# EAGLE design nxtMini (EAGLE 9.6.1)
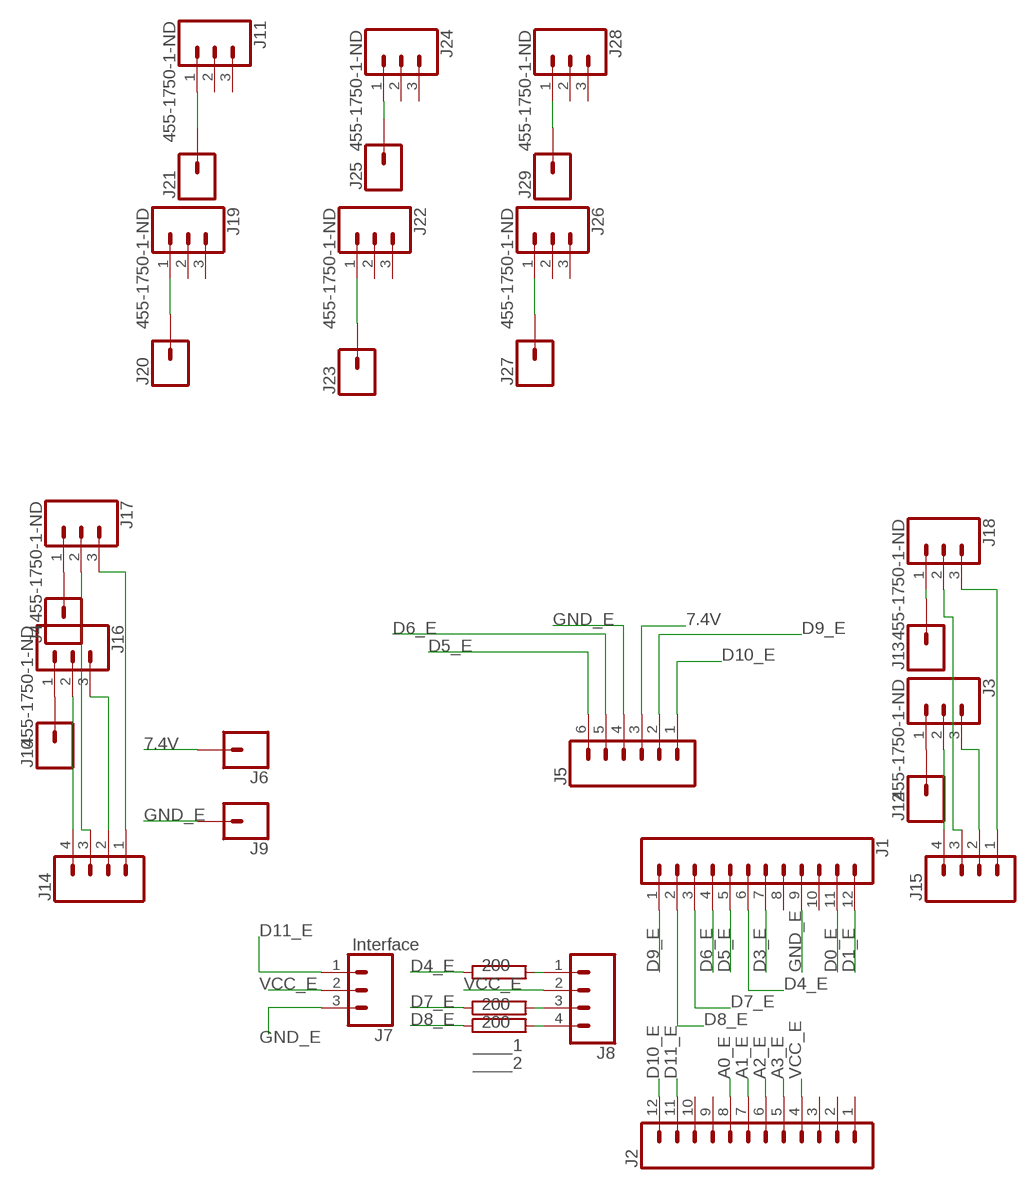
[diagram p0: schematic, sheet 1]

## Parts
200  RCA0001  [CA0001]
____1  200  RCA0001  [CA0001]
____2  200  RCA0001  [CA0001]
J1  CONN_12  [1X12]
J2  CONN_12  [1X12]
J3  455-1750-1-ND  CONN_03  [1X03]
J4  CONN_01  [1X01]
J5  CONN_06SILK_FEMALE_PTH  [1X06]
J6  CONN_01  [1X01]
J7  Interface  CONN_03  [1X03]
J8  CONN_04  [1X04]
J9  CONN_01  [1X01]
J10  CONN_01  [1X01]
J11  455-1750-1-ND  CONN_03  [1X03]
J12  CONN_01  [1X01]
J13  CONN_01  [1X01]
J14  CONN_04  [1X04]
J15  CONN_04  [1X04]
J16  455-1750-1-ND  CONN_03  [1X03]
J17  455-1750-1-ND  CONN_03  [1X03]
J18  455-1750-1-ND  CONN_03  [1X03]
J19  455-1750-1-ND  CONN_03  [1X03]
J20  CONN_01  [1X01]
J21  CONN_01  [1X01]
J22  455-1750-1-ND  CONN_03  [1X03]
J23  CONN_01  [1X01]
J24  455-1750-1-ND  CONN_03  [1X03]
J25  CONN_01  [1X01]
J26  455-1750-1-ND  CONN_03  [1X03]
J27  CONN_01  [1X01]
J28  455-1750-1-ND  CONN_03  [1X03]
J29  CONN_01  [1X01]

## Nets
7.4V: J5.3 J6.1
A0_E: J2.8
A1_E: J2.7
A2_E: J2.6
A3_E: J2.5
D0_E: J1.11
D1_E: J1.12
D3_E: J1.7
D4_E: 200.1 J1.6
D5_E: J1.5 J5.6
D6_E: J1.4 J5.5
D7_E: ____1.1 J1.3
D8_E: ____2.1 J1.2
D9_E: J1.1 J5.2
D10_E: J2.12 J5.1
D11_E: J2.11 J7.1
GND_E: J1.9 J5.4 J7.3 J9.1
N$1: J4.1 J17.1
N$2: J10.1 J16.1
N$3: 200.2 J8.1
N$4: ____1.2 J8.3
N$5: ____2.2 J8.4
N$6: J3.1 J12.1
N$7: J13.1 J18.1
N$8: J14.4 J16.2
N$9: J14.3 J17.2
N$10: J14.2 J16.3
N$11: J14.1 J17.3
N$12: J3.2 J15.4
N$13: J15.3 J18.2
N$14: J3.3 J15.2
N$15: J15.1 J18.3
N$16: J19.1 J20.1
N$17: J11.1 J21.1
N$18: J22.1 J23.1
N$19: J24.1 J25.1
N$20: J26.1 J27.1
N$21: J28.1 J29.1
VCC_E: J2.4 J7.2 J8.2
Unconnected: J1.8 J1.10 J2.1 J2.2 J2.3 J2.9 J2.10 J11.2 J11.3 J19.2 J19.3 J22.2 J22.3 J24.2 J24.3 J26.2 J26.3 J28.2 J28.3

## Library data of the parts
200 ____1 ____2 = resistor-power:R: Power Resitor; OC_FARNELL: unknown; OC_NEWARK: unknown
J1 J2 = SparkFun-Connectors:CONN_12: Multi connection point. Often used as Generic Header-pin footprint for 0.1 inch spaced/style header connections On any of the 0.1 inch spaced packages, you can populate with these: Break Away Headers - Straight <https://www.sparkfun.com/products/116> (PRT-00116) Break Away Male Headers - Right Angle <https://www.sparkfun.com/products/553> (PRT-00553) Female Headers <https://www.sparkfun.com/products/115> (PRT-00115) Break Away Headers - Machine Pin <https://www.sparkfun.com/products/117> (PRT-00117) Break Away Female Headers - Swiss Machine Pin <https://www.sparkfun.com/products/743> (PRT-00743) For SCREWTERMINALS and SPRING TERMINALS visit here: Screw Terimnals on SparkFun.com <https://www.sparkfun.com/search/results?term=Screw+Terminals> (5mm/3.5mm/2.54mm spacing) This device is also useful as a general connection point to wire up your design to another part of your project. Our various solder wires solder well into these plated through hole pads. Hook-Up Wire - Assortment (Stranded, 22 AWG) <https://www.sparkfun.com/products/11375> (PRT-11375) Hook-Up Wire - Assortment (Solid Core, 22 AWG) <https://www.sparkfun.com/products/11367> (PRT-11367) View the entire wire category on our website here <https://www.sparkfun.com/categories/141> Special notes: Molex polarized connector foot print use with SKU : PRT-08231 with associated crimp pins and housings. 1MM SMD Version SKU: PRT-10208 NOTES ON THE VARIANTS LOCK and LOCK_LONGPADS... This footprint was designed to help hold the alignment of a through-hole component (i.e. 6-pin header) while soldering it into place. You may notice that each hole has been shifted either up or down by 0.005 of an inch from it's more standard position (which is a perfectly straight line). This slight alteration caused the pins (the squares in the middle) to touch the edges of the holes. Because they are alternating, it causes a "brace" to hold the component in place. 0.005 has proven to be the perfect amount of "off-center" position when using our standard breakaway headers. Although looks a little odd when you look at the bare footprint, once you have a header in there, the alteration is very hard to notice. Also,if you push a header all the way into place, it is covered up entirely on the bottom side.
J3 J11 J16-J19 J22 J24 J26 J28 = SparkFun-Connectors:CONN_03: Multi connection point. Often used as Generic Header-pin footprint for 0.1 inch spaced/style header connections On any of the 0.1 inch spaced packages, you can populate with these: Break Away Headers - Straight <https://www.sparkfun.com/products/116> (PRT-00116) Break Away Male Headers - Right Angle <https://www.sparkfun.com/products/553> (PRT-00553) Female Headers <https://www.sparkfun.com/products/115> (PRT-00115) Break Away Headers - Machine Pin <https://www.sparkfun.com/products/117> (PRT-00117) Break Away Female Headers - Swiss Machine Pin <https://www.sparkfun.com/products/743> (PRT-00743) Stackable Header - 3 Pin (Female, 0.1") <https://www.sparkfun.com/products/13875> (PRT-13875) For SCREWTERMINALS and SPRING TERMINALS visit here: Screw Terimnals on SparkFun.com <https://www.sparkfun.com/search/results?term=Screw+Terminals> (5mm/3.5mm/2.54mm spacing) This device is also useful as a general connection point to wire up your design to another part of your project. Our various solder wires solder well into these plated through hole pads. Hook-Up Wire - Assortment (Stranded, 22 AWG) <https://www.sparkfun.com/products/11375> (PRT-11375) Hook-Up Wire - Assortment (Solid Core, 22 AWG) <https://www.sparkfun.com/products/11367> (PRT-11367) View the entire wire category on our website here <https://www.sparkfun.com/categories/141> Special notes: Molex polarized connector foot print use with SKU : PRT-08232 with associated crimp pins and housings.; PROD_ID: XXX-00000
J4 J6 J9 J10 J12 J13 J20 J21 J23 J25 J27 J29 = SparkFun-Connectors:CONN_01: Single connection point. Often used as Generic Header-pin footprint for 0.1 inch spaced/style header connections On any of the 0.1 inch spaced packages, you can populate with these: Break Away Headers - Straight <https://www.sparkfun.com/products/116> (PRT-00116) Break Away Male Headers - Right Angle <https://www.sparkfun.com/products/553> (PRT-00553) Female Headers <https://www.sparkfun.com/products/115> (PRT-00115) Break Away Headers - Machine Pin <https://www.sparkfun.com/products/117> (PRT-00117) Break Away Female Headers - Swiss Machine Pin <https://www.sparkfun.com/products/743> (PRT-00743) This device is also useful as a general connection point to wire up your design to another part of your project. Our various solder wires solder well into these plated through hole pads. Hook-Up Wire - Assortment (Stranded, 22 AWG) <https://www.sparkfun.com/products/11375> (PRT-11375) Hook-Up Wire - Assortment (Solid Core, 22 AWG) <https://www.sparkfun.com/products/11367> (PRT-11367) View the entire wire category on our website here <https://www.sparkfun.com/categories/141> Special notes: SMTSO-256-ET is a "flush mount" nut for a 4-40 screw. We mostly use this on specialty testbeds; it is a nice way to connect hardware to your PCB at an adjustable hieght. Also note, the SNAP packages are for using a snappable style connector. We sell a baggie of snaps and they are also used on two LilyPad designs: Snap Assortment - 30 pack (male and female) <https://www.sparkfun.com/products/11347> (DEV-11347) LilyPad Arduino SimpleSnap <https://www.sparkfun.com/products/10941> (DEV-10941) LilyPad SimpleSnap Protoboard <https://www.sparkfun.com/products/10940> (DEV-10940)
J5 = SparkFun-Connectors:CONN_06: Multi connection point. Often used as Generic Header-pin footprint for 0.1 inch spaced/style header connections On any of the 0.1 inch spaced packages, you can populate with these: Break Away Headers - Straight <https://www.sparkfun.com/products/116> (PRT-00116) Break Away Male Headers - Right Angle <https://www.sparkfun.com/products/553> (PRT-00553) Female Headers <https://www.sparkfun.com/products/115> (PRT-00115) Break Away Headers - Machine Pin <https://www.sparkfun.com/products/117> (PRT-00117) Break Away Female Headers - Swiss Machine Pin <https://www.sparkfun.com/products/743> (PRT-00743) Arduino Stackable Header - 6 Pin <https://www.sparkfun.com/products/9280> (PRT-09280) For SCREWTERMINALS and SPRING TERMINALS visit here: Screw Terimnals on SparkFun.com <https://www.sparkfun.com/search/results?term=Screw+Terminals> (5mm/3.5mm/2.54mm spacing) This device is also useful as a general connection point to wire up your design to another part of your project. Our various solder wires solder well into these plated through hole pads. Hook-Up Wire - Assortment (Stranded, 22 AWG) <https://www.sparkfun.com/products/11375> (PRT-11375) Hook-Up Wire - Assortment (Solid Core, 22 AWG) <https://www.sparkfun.com/products/11367> (PRT-11367) View the entire wire category on our website here <https://www.sparkfun.com/categories/141>; PROD_ID: CONN-08437
J7 = SparkFun-Connectors:CONN_03: Multi connection point. Often used as Generic Header-pin footprint for 0.1 inch spaced/style header connections On any of the 0.1 inch spaced packages, you can populate with these: Break Away Headers - Straight <https://www.sparkfun.com/products/116> (PRT-00116) Break Away Male Headers - Right Angle <https://www.sparkfun.com/products/553> (PRT-00553) Female Headers <https://www.sparkfun.com/products/115> (PRT-00115) Break Away Headers - Machine Pin <https://www.sparkfun.com/products/117> (PRT-00117) Break Away Female Headers - Swiss Machine Pin <https://www.sparkfun.com/products/743> (PRT-00743) Stackable Header - 3 Pin (Female, 0.1") <https://www.sparkfun.com/products/13875> (PRT-13875) For SCREWTERMINALS and SPRING TERMINALS visit here: Screw Terimnals on SparkFun.com <https://www.sparkfun.com/search/results?term=Screw+Terminals> (5mm/3.5mm/2.54mm spacing) This device is also useful as a general connection point to wire up your design to another part of your project. Our various solder wires solder well into these plated through hole pads. Hook-Up Wire - Assortment (Stranded, 22 AWG) <https://www.sparkfun.com/products/11375> (PRT-11375) Hook-Up Wire - Assortment (Solid Core, 22 AWG) <https://www.sparkfun.com/products/11367> (PRT-11367) View the entire wire category on our website here <https://www.sparkfun.com/categories/141> Special notes: Molex polarized connector foot print use with SKU : PRT-08232 with associated crimp pins and housings.; PROD_ID: XXX-00000; VALUE: 455-1750-1-ND
J8 J14 J15 = SparkFun-Connectors:CONN_04: Multi connection point. Often used as Generic Header-pin footprint for 0.1 inch spaced/style header connections On any of the 0.1 inch spaced packages, you can populate with these: Break Away Headers - Straight <https://www.sparkfun.com/products/116> (PRT-00116) Break Away Male Headers - Right Angle <https://www.sparkfun.com/products/553> (PRT-00553) Female Headers <https://www.sparkfun.com/products/115> (PRT-00115) Break Away Headers - Machine Pin <https://www.sparkfun.com/products/117> (PRT-00117) Break Away Female Headers - Swiss Machine Pin <https://www.sparkfun.com/products/743> (PRT-00743) For SCREWTERMINALS and SPRING TERMINALS visit here: Screw Terimnals on SparkFun.com <https://www.sparkfun.com/search/results?term=Screw+Terminals> (5mm/3.5mm/2.54mm spacing) This device is also useful as a general connection point to wire up your design to another part of your project. Our various solder wires solder well into these plated through hole pads. Hook-Up Wire - Assortment (Stranded, 22 AWG) <https://www.sparkfun.com/products/11375> (PRT-11375) Hook-Up Wire - Assortment (Solid Core, 22 AWG) <https://www.sparkfun.com/products/11367> (PRT-11367) View the entire wire category on our website here <https://www.sparkfun.com/categories/141> Special notes: Molex polarized connector foot print use with SKU : PRT-08231 with associated crimp pins and housings. 1MM SMD Version SKU: PRT-10208; PROD_ID: CONN-09696

## Net classes
0 default: width 0.254 mm, clearance 0.254 mm
1 power: width 0.61 mm, drill 0.711 mm, clearance 0.33 mm
2 gnd: width 0.305 mm, drill 0.711 mm, clearance 0.254 mm
3 usbvcc: width 0.508 mm, drill 0.711 mm, clearance 0.254 mm
4 aref: width 0.406 mm

## Board
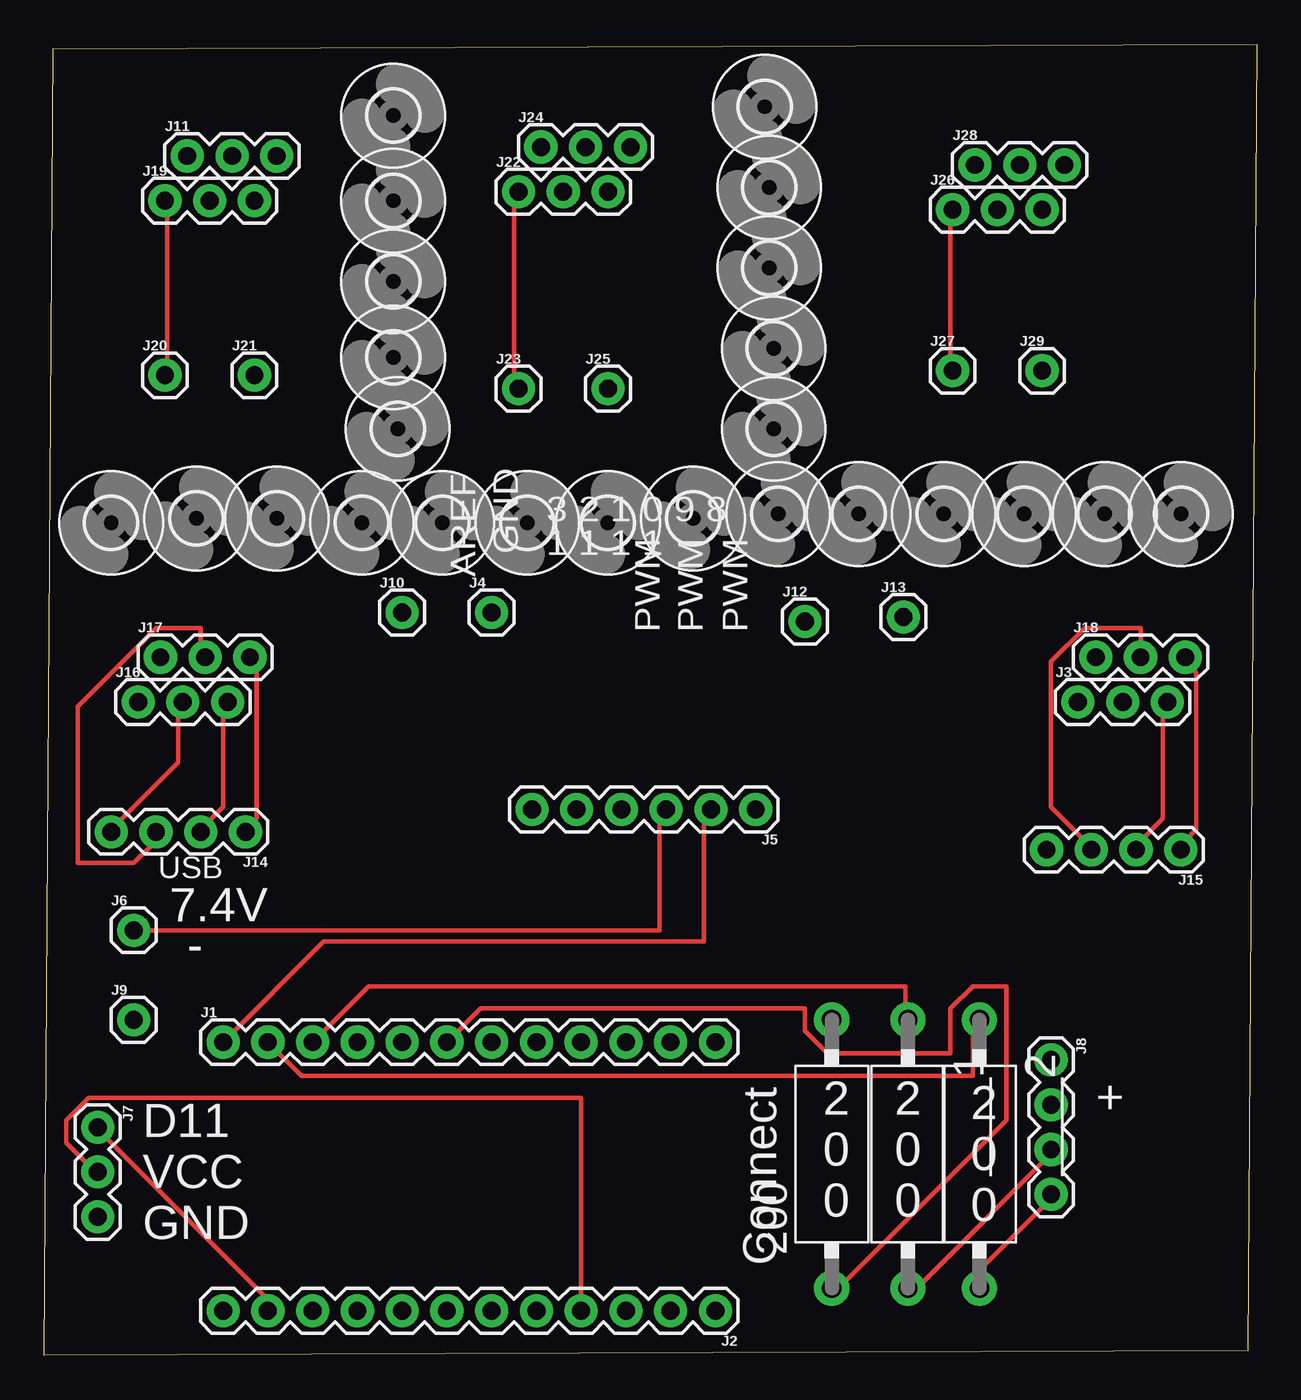
[diagram p1: board, top side]
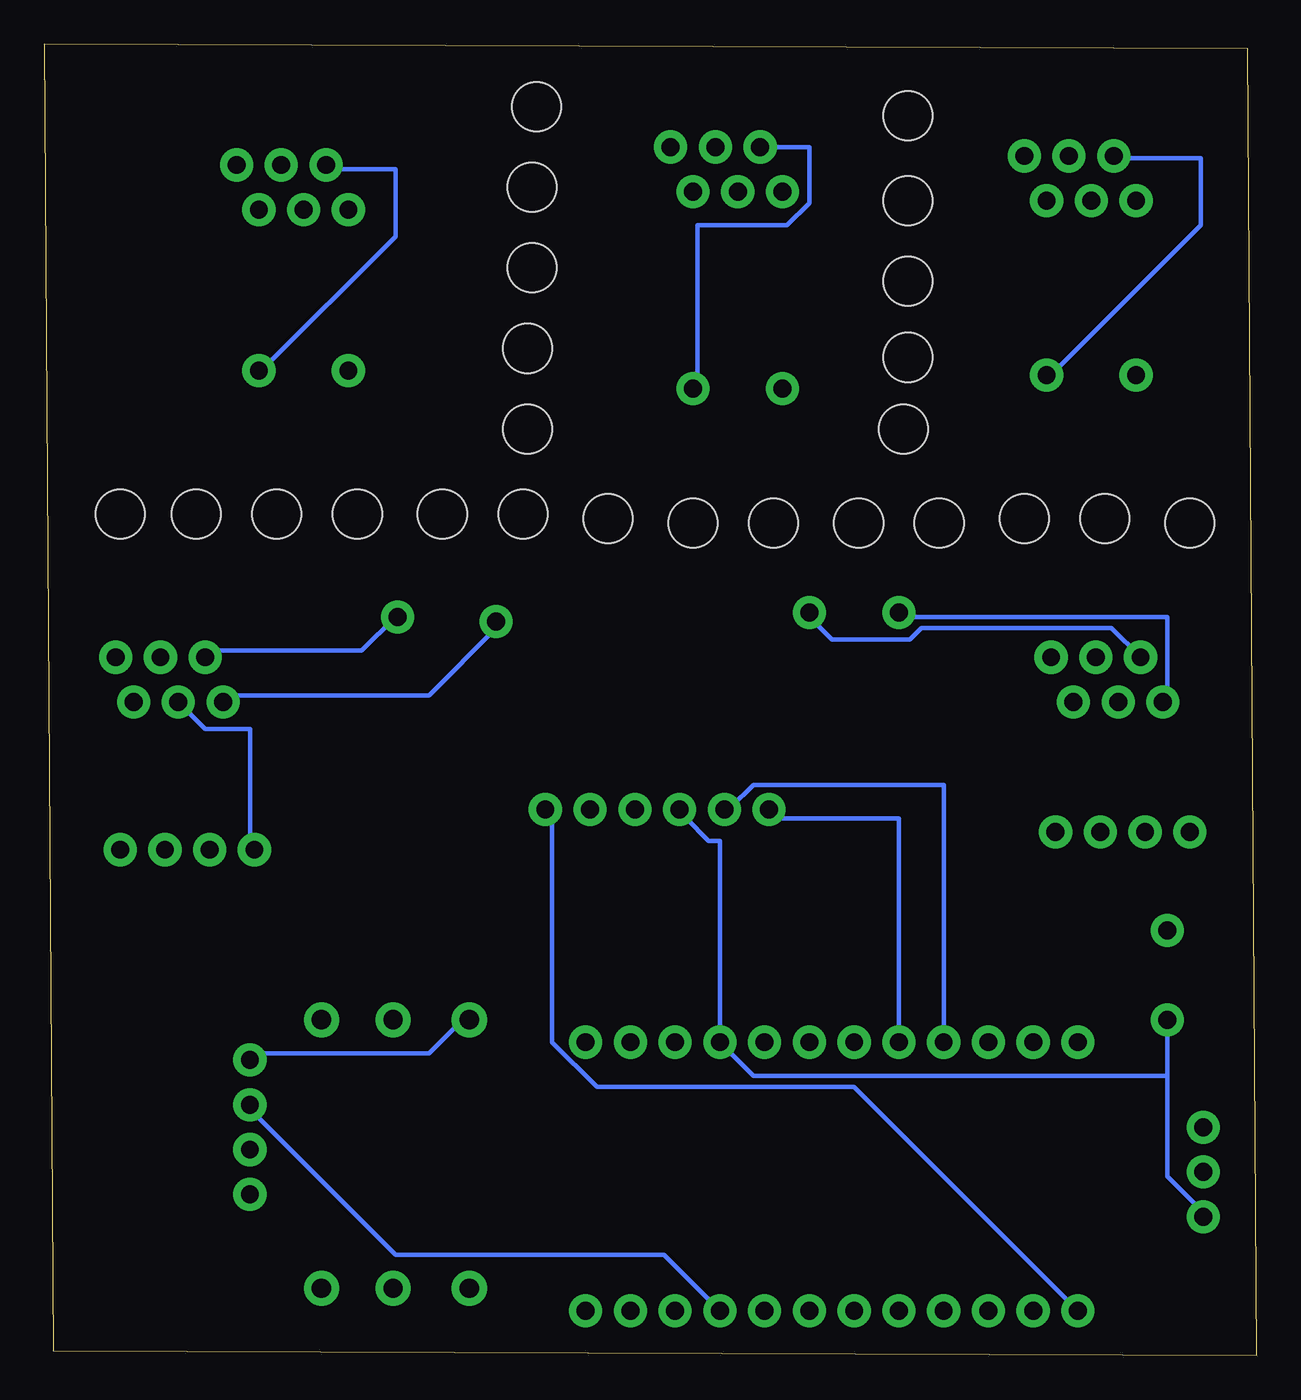
[diagram p2: board, bottom side, seen from below]

Size 68.83 x 74.42 mm. Coordinates in mm from the lower left corner, seen from the top.
Outline: 0.51,74.17 68.83,74.42 68.33,0.25 0,0 0.51,74.17
Copper layers (1*16): Top 0.035mm / dielectric 1.5mm / Bottom 0.035mm
Design rules "default": minimum track width 10mil, minimum drill 22mil, track to track 10mil, track to pad 10mil, pad to pad 10mil, via to via 16mil, smd to smd 8mil, copper to edge 30mil, drill to drill 12mil, minimum pad ring 10mil, minimum via ring 10mil, stop-mask expansion 4mil, vias tented up to drill 0mil, thermal gap 10mil
vRestrict: area 25.4,45.5 to 27.1,49.1; area 33.4,41 to 34.9,44.6; area 35.9,41 to 37.5,44.6; area 38.5,41 to 40,44.6; area 42.5,38.6 to 43.1,38.9

### Footprints (pad centres in the part's own frame; a part is rotated, then mirrored left to right if it is on the bottom)
CA0001 = drill 1.1 pad 2: 1 -7.62,0; 2 7.62,0
1X12 = drill 1.016 pad 1.88: 1 0,0; 2 2.54,0; 3 5.08,0; 4 7.62,0; 5 10.16,0; 6 12.7,0; 7 15.24,0; 8 17.78,0; 9 20.32,0; 10 22.86,0; 11 25.4,0; 12 27.94,0
1X03 = drill 1.016 pad 1.88: 1 0,0; 2 2.54,0; 3 5.08,0
1X01 = drill 1.016 pad 1.88: 1 0,0
1X06 = drill 1.016 pad 1.88: 1 0,0; 2 2.54,0; 3 5.08,0; 4 7.62,0; 5 10.16,0; 6 12.7,0
1X04 = drill 1.016 pad 1.88: 1 0,0; 2 2.54,0; 3 5.08,0; 4 7.62,0
2,8 = hole 2.8: 0,0

### Placement (x,y rotation side)
200  44.7,11.43 90 top
____1  49.02,11.43 270 top
____2  53.09,11.43 270 top
J1  10.16,17.78 0 top
J2  38.1,2.54 180 top
J3  58.67,37.08 0 top
J4  25.4,42.16 0 top
J5  40.39,30.99 180 top
J6  5.08,24.13 0 top
J7  3.05,12.95 270 top
J8  57.15,16.76 270 top
J9  5.08,19.05 0 top
J10  20.32,42.16 0 top
J11  8.13,68.07 0 top
J12  43.18,41.66 0 top
J13  48.77,41.91 0 top
J14  11.43,29.72 180 top
J15  64.52,28.7 180 top
J16  5.33,37.08 0 top
J17  6.6,39.62 0 top
J18  59.69,39.62 0 top
J19  6.86,65.53 0 top
J20  6.86,55.63 0 top
J21  11.94,55.63 0 top
J22  26.92,66.04 0 top
J23  26.92,54.86 0 top
J24  28.19,68.58 0 top
J25  32,54.86 0 top
J26  51.56,65.02 0 top
J27  51.56,55.88 0 top
J28  52.83,67.56 0 top
J29  56.64,55.88 0 top
U$1  [2,8]  3.81,47.24 0 top
U$2  [2,8]  8.64,47.5 0 top
U$3  [2,8]  13.21,47.5 0 top
U$4  [2,8]  18.03,47.24 0 top
U$5  [2,8]  22.61,47.24 0 top
U$6  [2,8]  27.43,47.24 0 top
U$7  [2,8]  32,47.24 0 top
U$8  [2,8]  36.83,47.5 0 top
U$9  [2,8]  41.66,47.75 0 top
U$10  [2,8]  46.23,47.75 0 top
U$11  [2,8]  51.05,47.75 0 top
U$12  [2,8]  55.63,47.75 0 top
U$13  [2,8]  60.2,47.75 0 top
U$14  [2,8]  64.52,47.75 0 top
U$15  [2,8]  19.81,70.36 0 top
U$16  [2,8]  19.81,65.53 0 top
U$17  [2,8]  19.81,60.96 0 top
U$18  [2,8]  19.81,56.64 0 top
U$19  [2,8]  20.07,52.58 0 top
U$20  [2,8]  40.89,70.87 0 top
U$21  [2,8]  41.15,66.29 0 top
U$22  [2,8]  41.15,61.72 0 top
U$23  [2,8]  41.4,57.15 0 top
U$24  [2,8]  41.4,52.58 0 top

### Tracks (layer width: path | path; a pad name or v marks a point on that pad's centre or on a via)
7.4V
  Top 0.254: J6.1 34.92,24.13 34.92,30.48 J5.3
D4_E
  Top 0.254: J1.6 24.77,19.68 43.18,19.68 43.18,18.41 44.45,17.14 51.44,17.14 51.44,19.68 52.7,20.95 54.61,20.95 54.61,13.34 45.09,3.81 200.1
D5_E
  Bottom 0.254: J1.5 20.32,30.48 27.3,30.48 J5.6
D6_E
  Bottom 0.254: J1.4 17.78,32.38 28.57,32.38 29.84,31.11 J5.5
D7_E
  Top 0.254: J1.3 18.41,20.95 48.9,20.95 48.9,19.05 ____1.1
D8_E
  Top 0.254: J1.2 14.61,15.88 52.7,15.88 52.7,19.05 ____2.1
D9_E
  Top 0.254: J1.1 15.88,23.5 37.47,23.5 37.47,30.48 J5.2
D10_E
  Bottom 0.254: J2.12 22.86,15.24 37.47,15.24 40.01,17.78 40.01,30.48 J5.1
D11_E
  Top 0.254: J2.11 12.7,3.17 3.17,12.7 J7.1
GND_E
  Bottom 0.254: J9.1 5.08,15.88 | 5.08,15.88 5.08,10.16 3.17,8.26 J7.3 | J5.4 32.38,30.48 31.11,29.21 30.48,29.21 J1.9 28.57,15.88 5.08,15.88
N$1
  Bottom 0.254: J17.1 8.26,41.27 19.05,41.27 19.68,40.64 24.13,40.64 25.4,41.91 J4.1
N$2
  Bottom 0.254: J16.1 5.08,37.47 5.08,41.91 20.32,41.91 J10.1
N$3
  Bottom 0.254: J8.1 57.15,17.14 46.99,17.14 45.09,19.05 200.2
N$4
  Top 0.254: J8.3 57.15,11.43 49.53,3.81 ____1.2
N$5
  Top 0.254: J8.4 57.15,8.89 53.34,5.08 53.34,3.81 ____2.2
N$6
  Bottom 0.254: J12.1 43.18,41.27 46.99,37.47 58.42,37.47 J3.1
N$7
  Bottom 0.254: J13.1 48.9,41.91 50.8,40.01 59.69,40.01 J18.1
N$8
  Top 0.254: J14.4 3.81,29.84 7.62,33.66 7.62,36.83 J16.2
N$9
  Top 0.254: J14.3 6.35,29.21 5.08,27.94 1.91,27.94 1.91,36.83 6.35,41.27 8.89,41.27 8.89,40.01 J17.2
N$10
  Top 0.254: J14.2 8.89,29.84 10.16,31.11 10.16,36.83 J16.3
N$11
  Top 0.254: J14.1 11.43,29.84 12.06,30.48 12.06,39.37 J17.3
N$12
  Bottom 0.254: J3.2 59.69,35.56 57.15,35.56 57.15,29.21 J15.4
N$13
  Top 0.254: J18.2 62.23,41.27 59.05,41.27 57.15,39.37 57.15,31.11 59.05,29.21 J15.3
N$14
  Top 0.254: J15.2 62.23,29.21 63.5,30.48 63.5,36.83 J3.3
N$15
  Top 0.254: J15.1 64.77,29.21 65.41,29.84 65.41,38.73 64.77,39.37 J18.3
N$16
  Top 0.254: J20.1 6.99,55.88 6.99,65.41 J19.1
N$17
  Bottom 0.254: J21.1 11.43,55.88 3.17,64.14 3.17,67.94 7.62,67.94 J11.1
N$18
  Top 0.254: J23.1 26.67,55.24 26.67,66.04 J22.1
N$19
  Bottom 0.254: J24.1 25.4,68.58 25.4,65.41 26.67,64.14 31.75,64.14 31.75,55.24 J25.1
N$20
  Top 0.254: J27.1 51.44,55.88 51.44,64.77 J26.1
N$21
  Bottom 0.254: J29.1 56.52,55.88 48.9,63.5 48.9,67.31 52.7,67.31 J28.1
VCC_E
  Top 0.254: J2.4 30.48,14.61 2.54,14.61 1.27,13.34 1.27,12.06 2.54,10.79 J7.2
  Bottom 0.254: J2.4 33.66,5.71 48.9,5.71 57.15,13.97 J8.2

### Text on the board
tNames: 3 2 1 0 9 8 | GND | 1 1 1 1 | AREF | PWM | PWM | PWM | USB
Reference: C8 | C2 | R11 | C4 | C5
_tsilk: 7.4V | - | Connect | + | 2 / 0 / 0 | 2 / 0 / 0 | 2 / 0 / 0 | D11 / VCC / GND